# Altium schematic sheet gad29c.SchDoc
size A; SheetNumber: 4; SheetTotal: 17
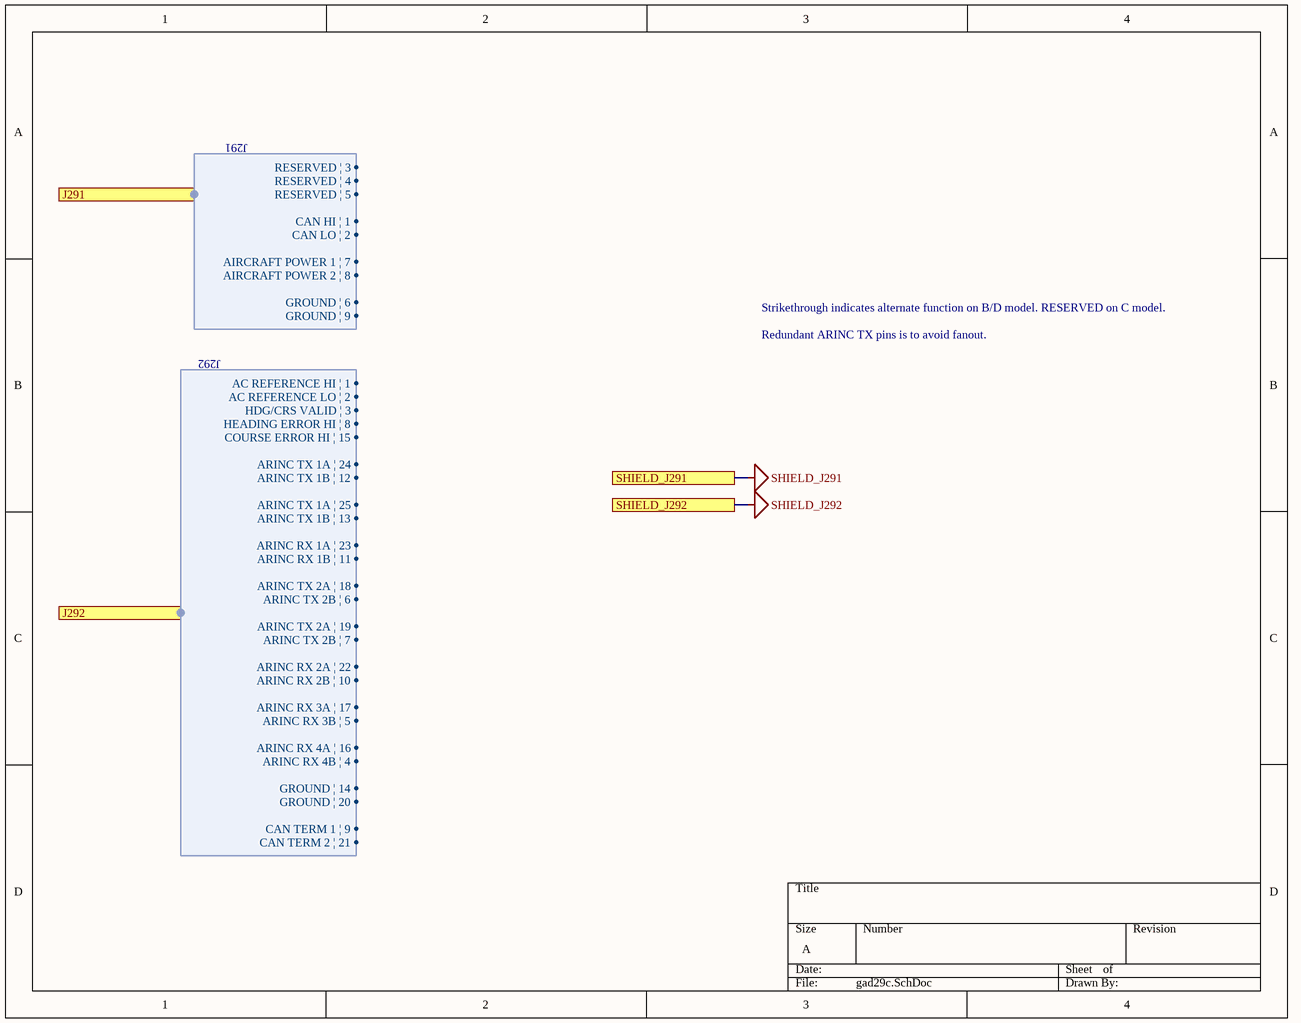
[diagram p0: gad29c.SchDoc]

## Ports
J291 (harness J291), J292 (harness J292), SHIELD_J291, SHIELD_J292

## Harnesses
J291: CAN HI | 1, CAN LO | 2, RESERVED | 3, RESERVED | 4, RESERVED | 5, GROUND | 6, AIRCRAFT POWER 1 | 7, AIRCRAFT POWER 2 | 8, GROUND | 9
J292: AC REFERENCE HI | 1, AC REFERENCE LO | 2, HDG/CRS VALID | 3, ARINC RX 4B | 4, ARINC RX 3B | 5, ARINC TX 2B | 6, ARINC TX 2B | 7, HEADING ERROR HI | 8, CAN TERM 1 | 9, ARINC RX 2B | 10, ARINC RX 1B | 11, ARINC TX 1B | 12, ARINC TX 1B | 13, GROUND | 14, COURSE ERROR HI | 15, ARINC RX 4A | 16, ARINC RX 3A | 17, ARINC TX 2A | 18, ARINC TX 2A | 19, GROUND | 20, CAN TERM 2 | 21, ARINC RX 2A | 22, ARINC RX 1A | 23, ARINC TX 1A | 24, ARINC TX 1A | 25

## Nets
SHIELD_J291: port SHIELD_J291
SHIELD_J292: port SHIELD_J292

## Notes on the sheet
- Strikethrough indicates alternate function on B/D model. RESERVED on C model.
- Redundant ARINC TX pins is to avoid fanout.